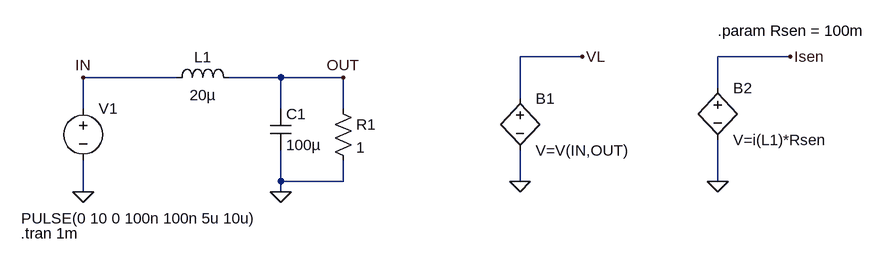
[diagram p0: schematic BV_source.asc]
BV_source.asc, the LTspice schematic file:
Version 4
SHEET 1 1336 680
WIRE 880 48 784 48
WIRE 1200 48 1088 48
WIRE 256 80 112 80
WIRE 416 80 336 80
WIRE 512 80 416 80
WIRE 1088 96 1088 48
WIRE 784 112 784 48
WIRE 112 128 112 80
WIRE 416 128 416 80
WIRE 512 128 512 80
WIRE 416 240 416 192
WIRE 512 240 512 208
WIRE 512 240 416 240
WIRE 784 240 784 192
WIRE 1088 240 1088 176
WIRE 112 256 112 208
WIRE 416 256 416 240
FLAG 416 256 0
FLAG 112 256 0
FLAG 112 80 IN
FLAG 512 80 OUT
FLAG 784 240 0
FLAG 1088 240 0
FLAG 880 48 VL
FLAG 1200 48 Isen
SYMBOL voltage 112 112 R0
WINDOW 3 -95 185 Left 2
WINDOW 123 0 0 Left 0
WINDOW 39 0 0 Left 0
SYMATTR InstName V1
SYMATTR Value PULSE(0 10 0 100n 100n 5u 10u)
SYMBOL ind 240 96 R270
WINDOW 0 32 56 VTop 2
WINDOW 3 5 56 VBottom 2
SYMATTR InstName L1
SYMATTR Value 20µ
SYMBOL res 496 112 R0
SYMATTR InstName R1
SYMATTR Value 1
SYMBOL cap 400 128 R0
SYMATTR InstName C1
SYMATTR Value 100µ
SYMBOL bv 784 96 R0
SYMATTR InstName B1
SYMATTR Value V=V(IN,OUT)
SYMBOL bv 1088 80 R0
SYMATTR InstName B2
SYMATTR Value V=i(L1)*Rsen
TEXT 16 320 Left 2 !.tran 1m
TEXT 1088 8 Left 2 !.param Rsen = 100m

The netlist it stands for:
* BV_source.asc
V1 IN 0 PULSE(0 10 0 100n 100n 5u 10u)
L1 IN OUT 20µ
R1 OUT 0 1
C1 OUT 0 100µ
B1 VL 0 V=V(IN,OUT)
B2 Isen 0 V=i(L1)*Rsen
.tran 1m
.param Rsen = 100m
.backanno
.end

* Results of the author's LTspice run, read from the files saved beside the schematic
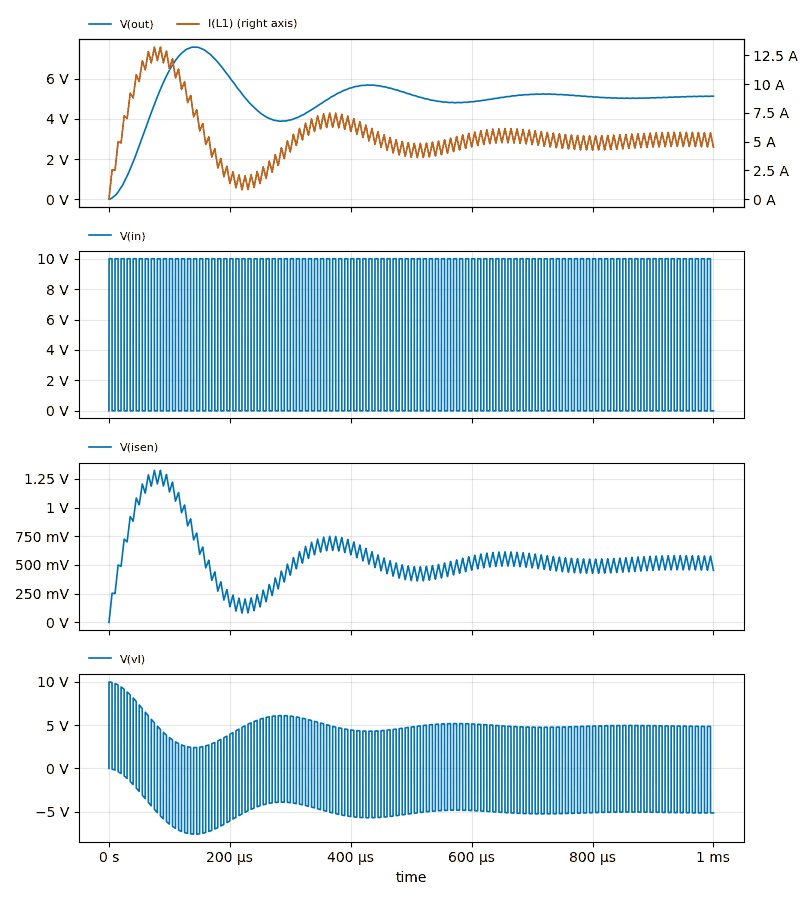
[diagram p1: Transient Analysis of BV_source.asc, plotted from the saved traces]
* Transient Analysis, 1 run:
*   V(out): min 0 V, max 7.585 V, average 5.01 V, rms 5.157 V, last 5.133 V
*   I(L1): min 0 A, max 13.23 A, average 5.523 A, rms 5.995 A, last 4.531 A
*   V(in): min 0 V, max 10 V, average 5.1 V, rms 7.127 V, last 0 V
*   V(isen): min 0 V, max 1.323 V, average 552.3 mV, rms 599.5 mV, last 453.1 mV
*   V(vl): min -7.585 V, max 10 V, average 90.21 mV, rms 5.143 V, last -5.133 V